# Altium schematic sheet 4-RF-PD.SchDoc
size A2
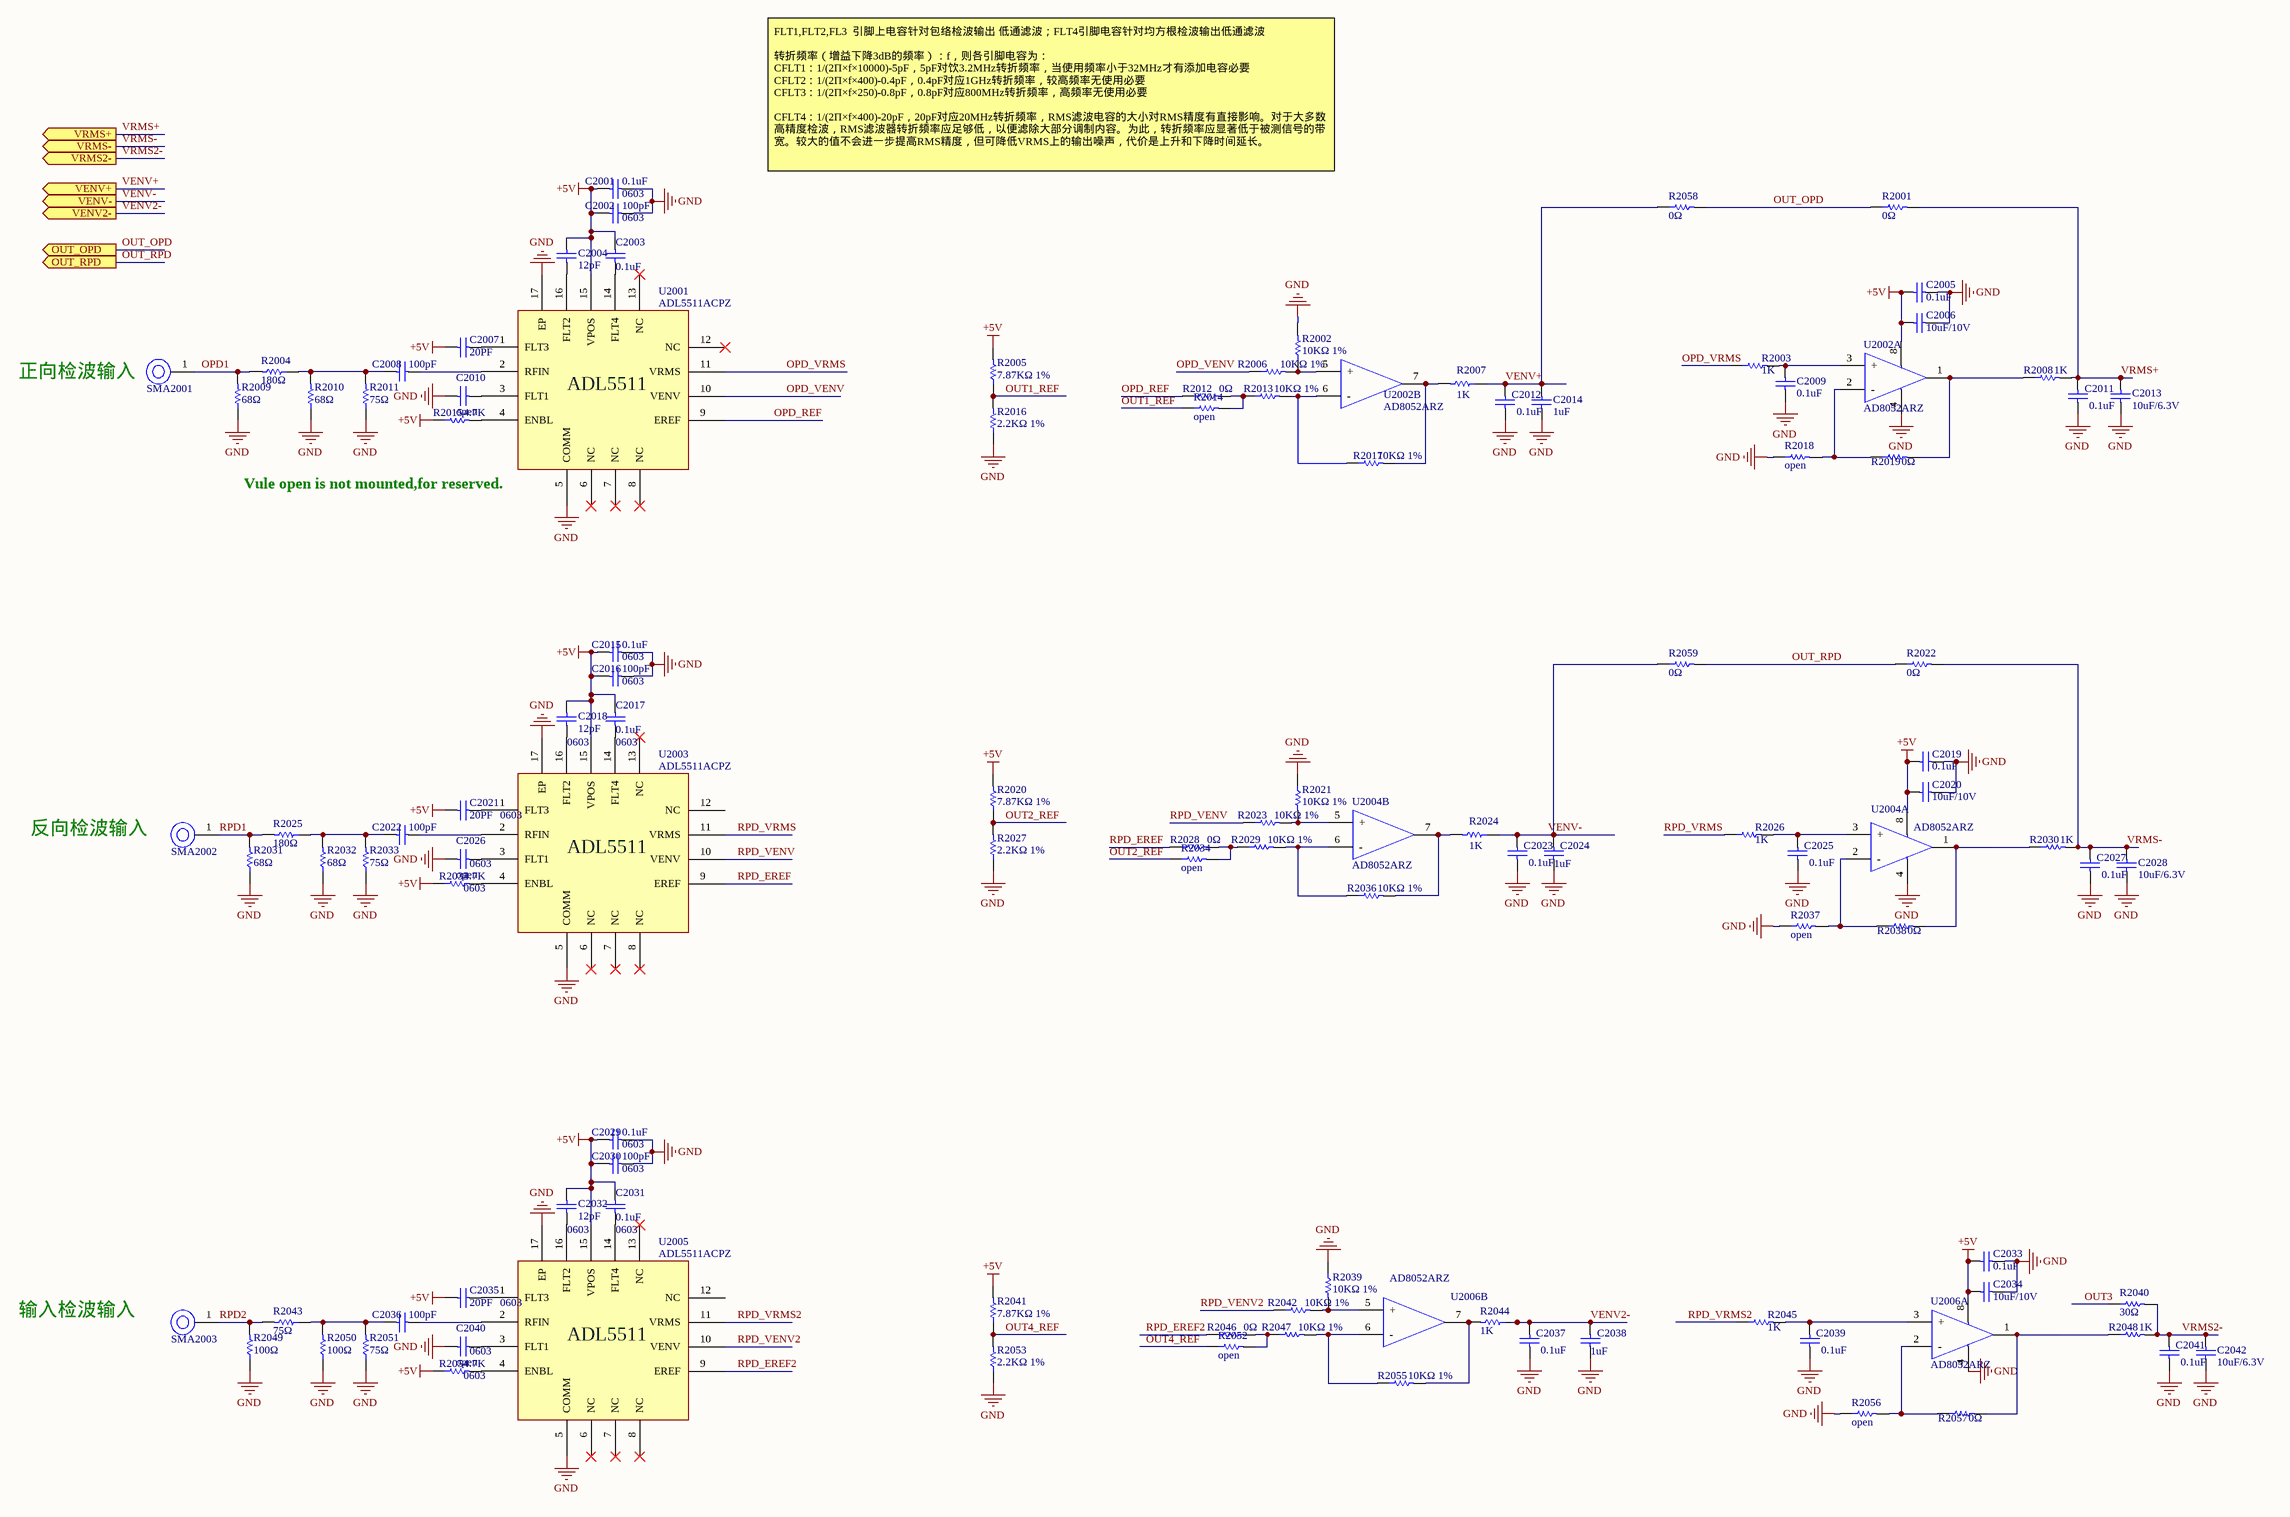
[diagram p0: 4-RF-PD.SchDoc]

## Parts
C2001  0.1uF  [C0603]
C2002  100pF  [C0603]
C2003  0.1uF  [C0603]
C2004  12pF  [C0603]
C2005  0.1uF  [C0603]
C2006  10uF/10V  [C0805]
C2007  20PF  [C0603]
C2008  100pF  [C0805]
C2009  0.1uF  [C0603]
C2010  open  [C0603]  (no BOM)
C2011  0.1uF  [C0603]
C2012  0.1uF  [C0603]
C2013  10uF/6.3V  [C0603]
C2014  1uF  [C0603]
C2015  0.1uF  [C0603]
C2016  100pF  [C0603]
C2017  0.1uF  [C0603]
C2018  12pF  [C0603]
C2019  0.1uF  [C0603]
C2020  10uF/10V  [C0805]
C2021  20PF  [C0603]
C2022  100pF  [C0805]
C2023  0.1uF  [C0603]
C2024  1uF  [C0603]
C2025  0.1uF  [C0603]
C2026  open  [C0603]  (no BOM)
C2027  0.1uF  [C0603]
C2028  10uF/6.3V  [C0603]
C2029  0.1uF  [C0603]
C2030  100pF  [C0603]
C2031  0.1uF  [C0603]
C2032  12pF  [C0603]
C2033  0.1uF  [C0603]
C2034  10uF/10V  [C0805]
C2035  20PF  [C0603]
C2036  100pF  [C0805]
C2037  0.1uF  [C0603]
C2038  1uF  [C0603]
C2039  0.1uF  [C0603]
C2040  open  [C0603]  (no BOM)
C2041  0.1uF  [C0603]
C2042  10uF/6.3V  [C0603]
R2001  0Ω  [R0603]  (no BOM)
R2002  10KΩ 1%  [R0603]
R2003  1K  [R0603]
R2004  180Ω  [R1206]
R2005  7.87KΩ 1%  [R0603]
R2006  10KΩ 1%  [R0603]
R2007  1K  [R0603]
R2008  1K  [R0603]
R2009  68Ω  [R1206]
R2010  68Ω  [R1206]
R2011  75Ω  [R0805]
R2012  0Ω  [R0603]
R2013  10KΩ 1%  [R0603]
R2014  open  [R0603]  (no BOM)
R2015  4.7K  [R0603]
R2016  2.2KΩ 1%  [R0603]
R2017  10KΩ 1%  [R0603]
R2018  open  [R0603]  (no BOM)
R2019  0Ω  [R0603]
R2020  7.87KΩ 1%  [R0603]
R2021  10KΩ 1%  [R0603]
R2022  0Ω  [R0603]  (no BOM)
R2023  10KΩ 1%  [R0603]
R2024  1K  [R0603]
R2025  180Ω  [R1206]
R2026  1K  [R0603]
R2027  2.2KΩ 1%  [R0603]
R2028  0Ω  [R0603]
R2029  10KΩ 1%  [R0603]
R2030  1K  [R0603]
R2031  68Ω  [R1206]
R2032  68Ω  [R1206]
R2033  75Ω  [R0805]
R2034  open  [R0603]  (no BOM)
R2035  4.7K  [R0603]
R2036  10KΩ 1%  [R0603]
R2037  open  [R0603]  (no BOM)
R2038  0Ω  [R0603]
R2039  10KΩ 1%  [R0603]
R2040  30Ω  [R0603]
R2041  7.87KΩ 1%  [R0603]
R2042  10KΩ 1%  [R0603]
R2043  75Ω  [R1206]
R2044  1K  [R0603]
R2045  1K  [R0603]
R2046  0Ω  [R0603]
R2047  10KΩ 1%  [R0603]
R2048  1K  [R0603]
R2049  100Ω  [R1206]
R2050  100Ω  [R1206]
R2051  75Ω  [R0805]
R2052  open  [R0603]  (no BOM)
R2053  2.2KΩ 1%  [R0603]
R2054  4.7K  [R0603]
R2055  10KΩ 1%  [R0603]
R2056  open  [R0603]  (no BOM)
R2057  0Ω  [R0603]
R2058  0Ω  [R0603]
R2059  0Ω  [R0603]
SMA2001  SMA-50KFD-4  [SMA-50KFD-4]  (value not drawn)  (no BOM)
SMA2002  SMA-50KFD-4  [SMA-50KFD-4]  (value not drawn)  (no BOM)
SMA2003  SMA-50KFD-4  [SMA-50KFD-4]  (value not drawn)  (no BOM)
U2001  ADL5511ACPZ  [QFN16_0R50_3X3]
U2002  AD8052ARZ  [SOIC8_1R27_3R9x4R9]  (parts A,B of 2)
U2003  ADL5511ACPZ  [QFN16_0R50_3X3]
U2004  AD8052ARZ  [SOIC8_1R27_3R9x4R9]  (parts A,B of 2)
U2005  ADL5511ACPZ  [QFN16_0R50_3X3]
U2006  AD8052ARZ  [SOIC8_1R27_3R9x4R9]  (parts A,B of 2)

## Ports
OUT_OPD (out), OUT_RPD (out), VENV2- (out), VENV+ (out), VENV- (out), VRMS2- (out), VRMS+ (out), VRMS- (out)

## Nets
+5V: C2001.2 C2002.1 C2003.2 C2004.2 C2005.1 C2006.1 C2007.1 C2015.2 C2016.1 C2017.2 C2018.2 C2019.1 C2020.1 C2021.1 C2029.2 C2030.1 C2031.2 C2032.2 C2033.1 C2034.1 C2035.1 R2005.2 R2015.1 R2020.2 R2035.1 R2041.2 R2054.1 U2001.15(VPOS) U2002.8 U2003.15(VPOS) U2004.8 U2005.15(VPOS) U2006.8
GND: C2001.1 C2002.2 C2005.2 C2006.2 C2009.1 C2010.1 C2011.1 C2012.1 C2013.1 C2014.1 C2015.1 C2016.2 C2019.2 C2020.2 C2023.1 C2024.1 C2025.1 C2026.1 C2027.1 C2028.1 C2029.1 C2030.2 C2033.2 C2034.2 C2037.1 C2038.1 C2039.1 C2040.1 C2041.1 C2042.1 R2002.2 R2009.1 R2010.1 R2011.1 R2016.1 R2018.1 R2021.1 R2027.1 R2031.1 R2032.1 R2033.1 R2037.1 R2039.1 R2049.1 R2050.1 R2051.1 R2053.1 R2056.1 U2001.5(COMM) U2001.17(EP) U2002.4 U2003.5(COMM) U2003.17(EP) U2004.4 U2005.5(COMM) U2005.17(EP) U2006.4
OPD1: R2004.2 R2009.2 SMA2001.1(Sig)
OPD_REF: R2012.1 U2001.9(EREF)
OPD_VENV: R2006.1 U2001.10(VENV)
OPD_VRMS: R2003.1 U2001.11(VRMS)
OUT1_REF: R2005.1 R2014.1 R2016.2
OUT2_REF: R2020.1 R2027.2 R2034.1
OUT3: R2040.1
OUT4_REF: R2041.1 R2052.1 R2053.2
OUT_OPD: R2001.1 R2058.2 ; port OUT_OPD
OUT_RPD: R2022.1 R2059.2 ; port OUT_RPD
RPD1: R2025.2 R2031.2 SMA2002.1(Sig)
RPD2: R2043.2 R2049.2 SMA2003.1(Sig)
RPD_EREF: R2028.1 U2003.9(EREF)
RPD_EREF2: R2046.1 U2005.9(EREF)
RPD_VENV: R2023.1 U2003.10(VENV)
RPD_VENV2: R2042.1 U2005.10(VENV)
RPD_VRMS: R2026.1 U2003.11(VRMS)
RPD_VRMS2: R2045.1 U2005.11(VRMS)
VENV2-: C2037.2 C2038.2 R2044.1 ; port VENV2-
VENV+: C2012.2 C2014.2 R2007.1 R2058.1 ; port VENV+
VENV-: C2023.2 C2024.2 R2024.1 R2059.1 ; port VENV-
VRMS2-: C2041.2 C2042.2 R2040.2 R2048.2 ; port VRMS2-
VRMS+: C2011.2 C2013.2 R2001.2 R2008.2 ; port VRMS+
VRMS-: C2027.2 C2028.2 R2022.2 R2030.2 ; port VRMS-
NetC2003_1: C2003.1 U2001.14(FLT4)
NetC2004_1: C2004.1 U2001.16(FLT2)
NetC2007_2: C2007.2 U2001.1(FLT3)
NetC2008_1: C2008.1 R2004.1 R2010.2 R2011.2
NetC2008_2: C2008.2 U2001.2(RFIN)
NetC2009_2: C2009.2 R2003.2 U2002.3(+)
NetC2010_2: C2010.2 U2001.3(FLT1)
NetC2017_1: C2017.1 U2003.14(FLT4)
NetC2018_1: C2018.1 U2003.16(FLT2)
NetC2021_2: C2021.2 U2003.1(FLT3)
NetC2022_1: C2022.1 R2025.1 R2032.2 R2033.2
NetC2022_2: C2022.2 U2003.2(RFIN)
NetC2025_2: C2025.2 R2026.2 U2004.3(+)
NetC2026_2: C2026.2 U2003.3(FLT1)
NetC2031_1: C2031.1 U2005.14(FLT4)
NetC2032_1: C2032.1 U2005.16(FLT2)
NetC2035_2: C2035.2 U2005.1(FLT3)
NetC2036_1: C2036.1 R2043.1 R2050.2 R2051.2
NetC2036_2: C2036.2 U2005.2(RFIN)
NetC2039_2: C2039.2 R2045.2 U2006.3(+)
NetC2040_2: C2040.2 U2005.3(FLT1)
NetR2002_1: R2002.1 R2006.2 U2002.5(+)
NetR2007_2: R2007.2 R2017.2 U2002.7
NetR2008_1: R2008.1 R2019.2 U2002.1
NetR2012_2: R2012.2 R2013.1 R2014.2
NetR2013_2: R2013.2 R2017.1 U2002.6(-)
NetR2015_2: R2015.2 U2001.4(ENBL)
NetR2018_2: R2018.2 R2019.1 U2002.2(-)
NetR2021_2: R2021.2 R2023.2 U2004.5(+)
NetR2024_2: R2024.2 R2036.2 U2004.7
NetR2028_2: R2028.2 R2029.1 R2034.2
NetR2029_2: R2029.2 R2036.1 U2004.6(-)
NetR2030_1: R2030.1 R2038.2 U2004.1
NetR2035_2: R2035.2 U2003.4(ENBL)
NetR2037_2: R2037.2 R2038.1 U2004.2(-)
NetR2039_2: R2039.2 R2042.2 U2006.5(+)
NetR2044_2: R2044.2 R2055.2 U2006.7
NetR2046_2: R2046.2 R2047.1 R2052.2
NetR2047_2: R2047.2 R2055.1 U2006.6(-)
NetR2048_1: R2048.1 R2057.2 U2006.1
NetR2054_2: R2054.2 U2005.4(ENBL)
NetR2056_2: R2056.2 R2057.1 U2006.2(-)

Not connected (* = marked no-connect by the designer): U2001 6(NC)* 7(NC)* 8(NC)* 12(NC)* 13(NC)*; U2003 6(NC)* 7(NC)* 8(NC)* 12(NC) 13(NC)*; U2005 6(NC)* 7(NC)* 8(NC)* 12(NC) 13(NC)*

## Notes on the sheet
- FLT1,FLT2,FL3  引脚上电容针对包络检波输出 低通滤波；FLT4引脚电容针对均方根检波输出低通滤波
  转折频率（增益下降3dB的频率）：f，则各引脚电容为：
  CFLT1：1/(2Π×f×10000)-5pF，5pF对饮3.2MHz转折频率，当使用频率小于32MHz才有添加电容必要
  CFLT2：1/(2Π×f×400)-0.4pF，0.4pF对应1GHz转折频率，较高频率无使用必要
  CFLT3：1/(2Π×f×250)-0.8pF，0.8pF对应800MHz转折频率，高频率无使用必要
  CFLT4：1/(2Π×f×400)-20pF，20pF对应20MHz转折频率，RMS滤波电容的大小对RMS精度有直接影响。对于大多数高精度检波，RMS滤波器转折频率应足够低，以便滤除大部分调制内容。为此，转折频率应显著低于被测信号的带宽。较大的值不会进一步提高RMS精度，但可降低VRMS上的输出噪声，代价是上升和下降时间延长。
- (near C2002) 0603
- (near C2001) 0603
- 正向检波输入
- (near U2001) Vule open is not mounted,for reserved.
- (near C2015) 0603
- (near C2016) 0603
- (near C2018) 0603
- (near C2017) 0603
- 反向检波输入
- (near U2003) 0603
- (near R2035) 0603
- (near C2026) 0603
- (near C2029) 0603
- (near C2030) 0603
- (near C2032) 0603
- (near C2031) 0603
- 输入检波输入
- (near U2005) 0603
- (near R2054) 0603
- (near C2040) 0603
- (in symbol ADL5511ACPZ) ADL5511

## Library data of the parts
C2001 C2003 C2005 C2009 C2011 C2012 C2015 C2017 C2019 C2023 C2025 C2027 C2029 C2031 C2033 C2037 C2039 C2041 = 0.1uF贴片电容: 贴片电容_GRM188R71H104KA01D_0.1uF±10%,50V,0603; code: 01010045
C2002 C2016 C2030 = 1000pF贴片电容: 贴片电容_100pF±10%,50V,0603
C2004 C2018 C2032 = 10pF贴片电容: GRM1885C1H390JA01D_39pF±5%,50V,0603; code: 01010157
C2006 C2020 C2034 = 10uF贴片电容: 贴片电容_GRM21BR61A106KE19L_10uF±10%,10V,0805; code: 01010036
C2007 C2021 C2035 = 10pF贴片电容: 贴片电容_GRM1885C1H680JA01D_0603,68PF,50V,±5％,COG; MPN: Murata; code: 01010034
C2008 C2022 C2036 = 100pF贴片电容: 贴片电容_GRM2165C1H101JA01D_100pF±5%,50V,0805; code: 01010043
C2010 C2026 C2040 = 1000pF贴片电容: 贴片电容_GRM188R71H102KA01_1000pF±10%,50V,0603; code: 01010093
C2013 C2028 C2042 = 10uF贴片电容: 贴片电容_GRM188R60J106ME47D_10uF±20%,6.3V,0603; code: 01010037
C2014 C2024 C2038 = 10uF贴片电容: code: 01010037
R2001 R2007 R2022 R2024 R2040 R2044 R2058 R2059 = 0Ω贴片电阻: code: 01020010
R2002 R2006 R2013 R2017 R2021 R2023 R2029 R2036 R2039 R2042 R2047 R2055 = 430Ω贴片电阻: code: 01020118
R2003 R2026 R2045 = 1K贴片电阻: 贴片电阻_1K±5%,0603; code: 01020082
R2004 R2025 = 56Ω贴片电阻: 贴片电阻_1206,180Ω,±5％
R2005 R2020 R2041 = 0Ω贴片电阻: 0603,7.87KΩ,±1％; code: 01020010
R2008 R2012 R2014 R2019 R2028 R2030 R2034 R2038 R2046 R2048 R2052 R2057 = 0Ω贴片电阻: 贴片电阻_0Ω±5%,0603; code: 01020010
R2009 R2010 R2031 R2032 = 56Ω贴片电阻: 贴片电阻_68Ω±5%,1206
R2011 R2033 R2051 = 75Ω贴片电阻: 贴片电阻_75Ω±5%,0805; code: 01020068
R2015 R2035 R2054 = 4.7K贴片电阻: 贴片电阻_4.7K±5%,0603; code: 01020012
R2016 R2027 R2053 = 0Ω贴片电阻: 0603,2.2KΩ,±1％; code: 01020010
R2018 R2037 R2056 = 0Ω贴片电阻
R2043 = 56Ω贴片电阻: 贴片电阻_75Ω±5%,1206
R2049 R2050 = 56Ω贴片电阻: 贴片电阻_100Ω±5%,1206
SMA2001-SMA2003 = SMA-50KFD-4: 射频同轴连接器_SMA-50KFD-4; code: 03100009
U2001 U2003 U2005 = ADL5511ACPZ: 检波器_ADL5511ACPZ_DC~6GHz,LFCSP16; code: 01060108
U2002 U2006 = OP284: Maker: TI; code: 01060201
U2004 = LM358: 运算放大器_LM358_SOIC8; Maker: MOTOROLA; code: 01060025